# Altium schematic sheet CL10C200JB8NNNC.schdoc
size 127 x 101 mm
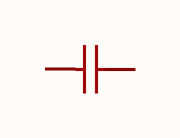
[diagram p0: CL10C200JB8NNNC.schdoc]

## Parts
C?  cl10c200jb8nnnc  [C0603]  (value not drawn)

## Nets

Not connected (* = marked no-connect by the designer): C? 1 2

## Library data of the parts
C? = cl10c200jb8nnnc: 容值:20pF;精度:±5%;额定电压:50V;温度系数:C0G;; Manufacturer: SAMSUNG(三星); AddInBom: yes; ModelId: ac125912035d415993ca9572d50418b1; ModelName: C0603_L1.6-W0.8-H0.8; ModelTransform: 62.992,31.496,0,0,0,0,0,0,0; Value: 20pF; Tolerance: ±5%; Voltage Rating: 50V; Temperature Coefficient: C0G; Symbol: CL10C200JB8NNNC; LCSC Part Name: 20pF ±5% 50V; SupplierPart: C1648; ManufacturerPart: CL10C200JB8NNNC; Supplier Footprint: 0603; JLCPCB Part Class: Basic Part; Datasheet: https://item.szlcsc.com/datasheet/CL10C200JB8NNNC/2000.html; Supplier: LCSC; ConvertToPcb: yes; FootprintName: C0603